# EAGLE design nRF52832_MCU (EAGLE 7.6.0)

## Sheet 1 of 2
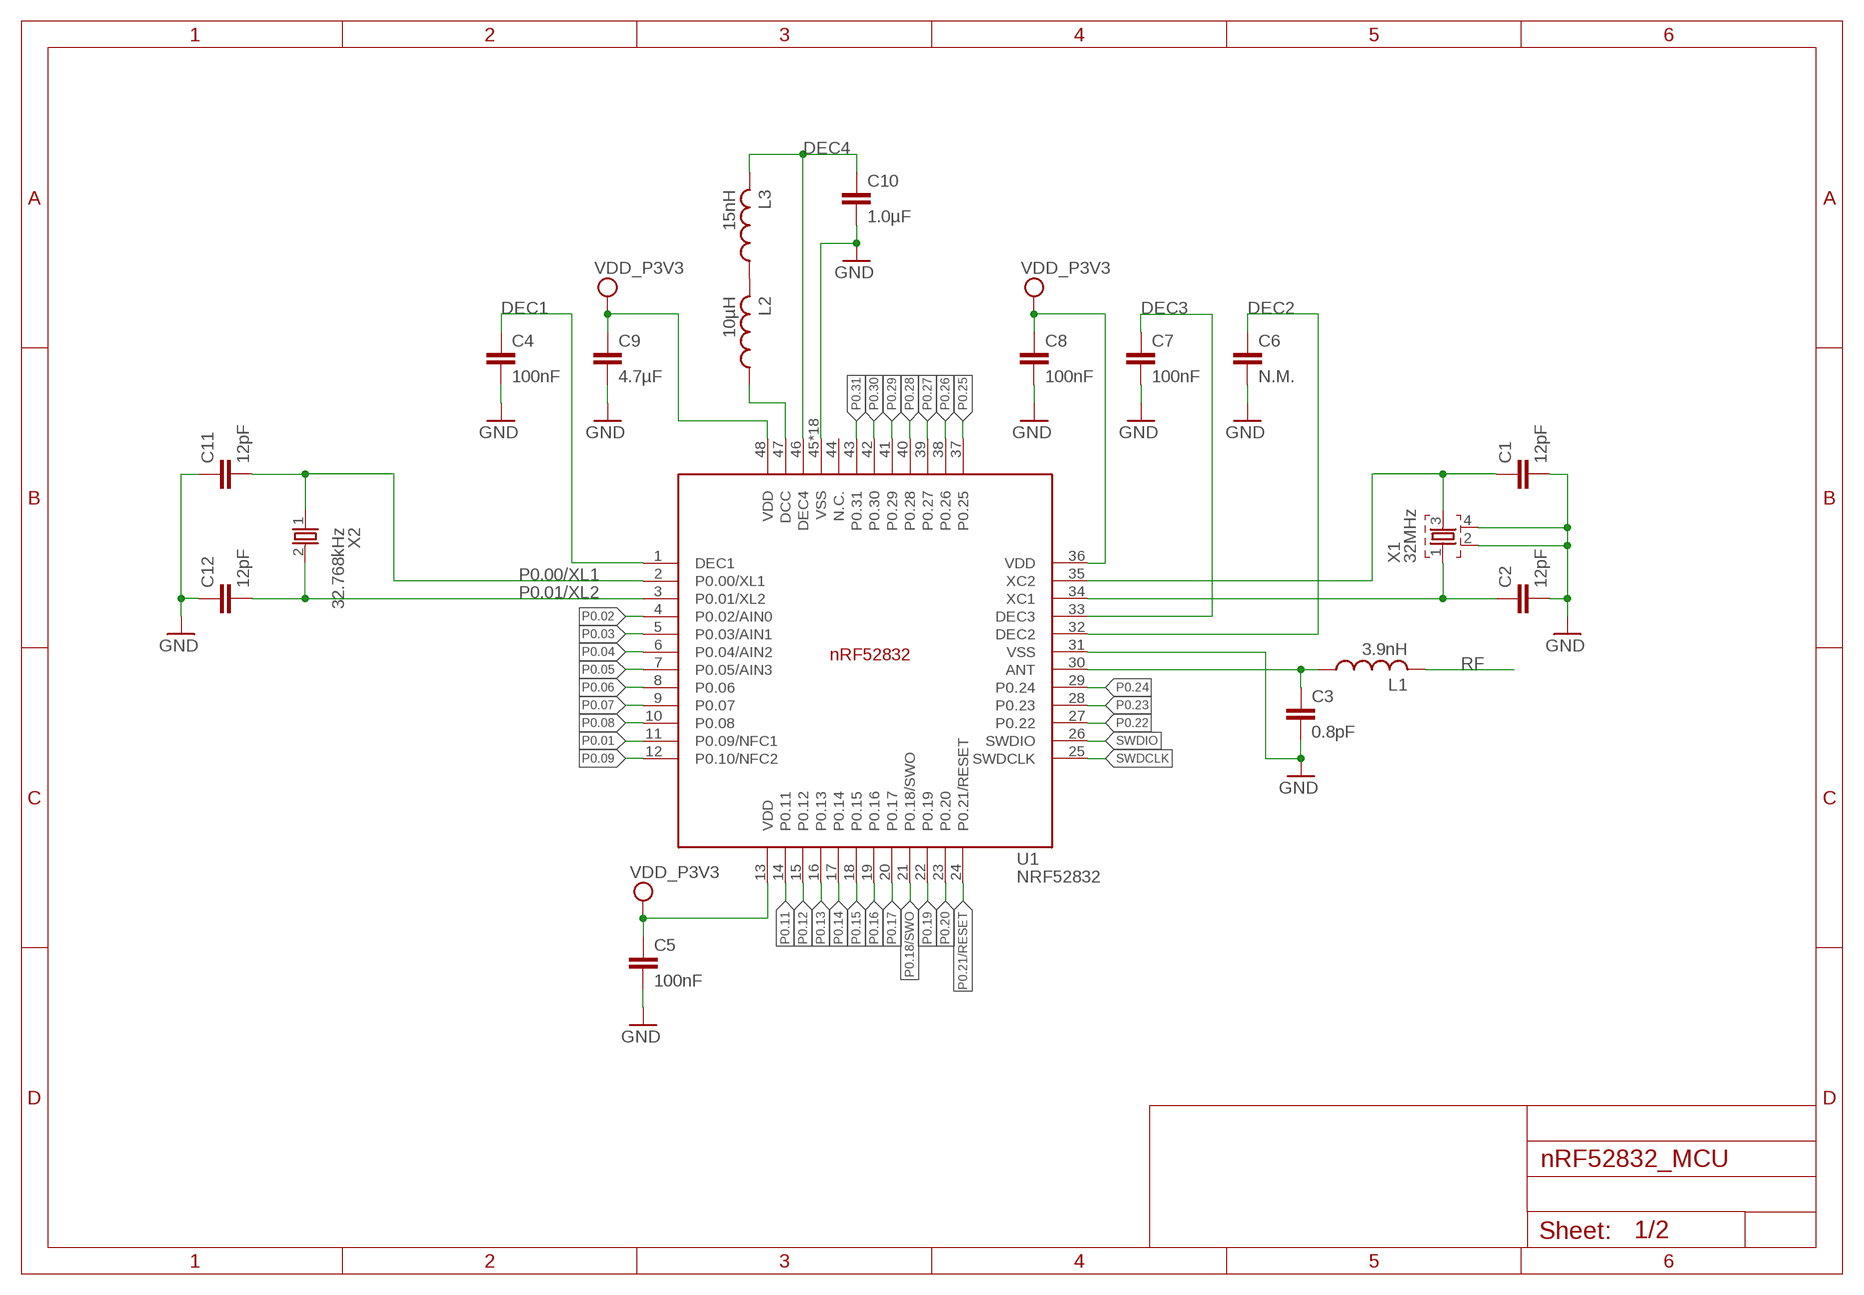
[diagram p0: schematic, sheet 1]

### Parts
C1  12pF  CAPACITOR_0402_N  [RESC0402_N]
C2  12pF  CAPACITOR_0402_N  [RESC0402_N]
C3  0.8pF  CAPACITOR_0402_N  [RESC0402_N]
C4  100nF  CAPACITOR_0402_N  [RESC0402_N]
C5  100nF  CAPACITOR_0402_N  [RESC0402_N]
C6  N.M.  CAPACITOR_0402_N  [RESC0402_N]
C7  100nF  CAPACITOR_0402_N  [RESC0402_N]
C8  100nF  CAPACITOR_0402_N  [RESC0402_N]
C9  4.7µF  CAPACITOR_0603_N  [RESC0603_N]
C10  1.0µF  CAPACITOR_0603_N  [RESC0603_N]
C11  12pF  CAPACITOR_0402_N  [RESC0402_N]
C12  12pF  CAPACITOR_0402_N  [RESC0402_N]
L1  3.9nH  INDUCTOR_0402_N  [RESC0402_N]
L2  10µH  INDUCTOR_0603_N  [RESC0603_N]
L3  15nH  INDUCTOR_0402_N  [RESC0402_N]
U1  NRF52832  [QFN40P600X600X90-48_N]
X1  32MHz  XTAL_32MHZ  [BT-XTAL_2016_N]
X2  32.768kHz  XTAL_32KHZ  [XTAL_3215_N]

### Nets
ANT: C3.1 L1.1 U1.30(ANT)
DEC1: C4.1 U1.1(DEC1)
DEC2: C6.1 U1.32(DEC2)
DEC3: C7.1 U1.33(DEC3)
DEC4: C10.1 L3.2 U1.46(DEC4)
GND: C1.2 C2.2 C3.2 C4.2 C5.2 C6.2 C7.2 C8.2 C9.2 C10.2 C11.1 C12.1 U1.31(VSS) U1.45(VSS) U1.PAD(VSS) U1.PAD@VIA01(VSS) U1.PAD@VIA02(VSS) U1.PAD@VIA03(VSS) U1.PAD@VIA04(VSS) U1.PAD@VIA05(VSS) U1.PAD@VIA06(VSS) U1.PAD@VIA07(VSS) U1.PAD@VIA08(VSS) U1.PAD@VIA09(VSS) U1.PAD@VIA10(VSS) U1.PAD@VIA11(VSS) U1.PAD@VIA12(VSS) U1.PAD@VIA13(VSS) U1.PAD@VIA14(VSS) U1.PAD@VIA15(VSS) U1.PAD@VIA16(VSS) X1.2 X1.4
N$2: L2.2 L3.1
N$3: C1.1 U1.35(XC2) X1.3
N$4: L2.1 U1.47(DCC)
P0.00/XL1: C11.2 U1.2(P0.00/XL1) X2.1
P0.01: U1.11(P0.09/NFC1)
P0.01/XL2: C12.2 U1.3(P0.01/XL2) X2.2
P0.02: U1.4(P0.02/AIN0)
P0.03: U1.5(P0.03/AIN1)
P0.04: U1.6(P0.04/AIN2)
P0.05: U1.7(P0.05/AIN3)
P0.06: U1.8(P0.06)
P0.07: U1.9(P0.07)
P0.08: U1.10(P0.08)
P0.09: U1.12(P0.10/NFC2)
P0.11: U1.14(P0.11)
P0.12: U1.15(P0.12)
P0.13: U1.16(P0.13)
P0.14: U1.17(P0.14)
P0.15: U1.18(P0.15)
P0.16: U1.19(P0.16)
P0.17: U1.20(P0.17)
P0.18/SWO: U1.21(P0.18/SWO)
P0.19: U1.22(P0.19)
P0.20: U1.23(P0.20)
P0.21/RESET: U1.24(P0.21/RESET)
P0.22: U1.27(P0.22)
P0.23: U1.28(P0.23)
P0.24: U1.29(P0.24)
P0.25: U1.37(P0.25)
P0.26: U1.38(P0.26)
P0.27: U1.39(P0.27)
P0.28: U1.40(P0.28)
P0.29: U1.41(P0.29)
P0.30: U1.42(P0.30)
P0.31: U1.43(P0.31)
RF: L1.2
SWDCLK: U1.25(SWDCLK)
SWDIO: U1.26(SWDIO)
VDD_P3V3: C5.1 C8.1 C9.1 U1.13(VDD) U1.36(VDD) U1.48(VDD)
X1: C2.1 U1.34(XC1) X1.1
Unconnected: U1.44(N.C.)

## Sheet 2 of 2
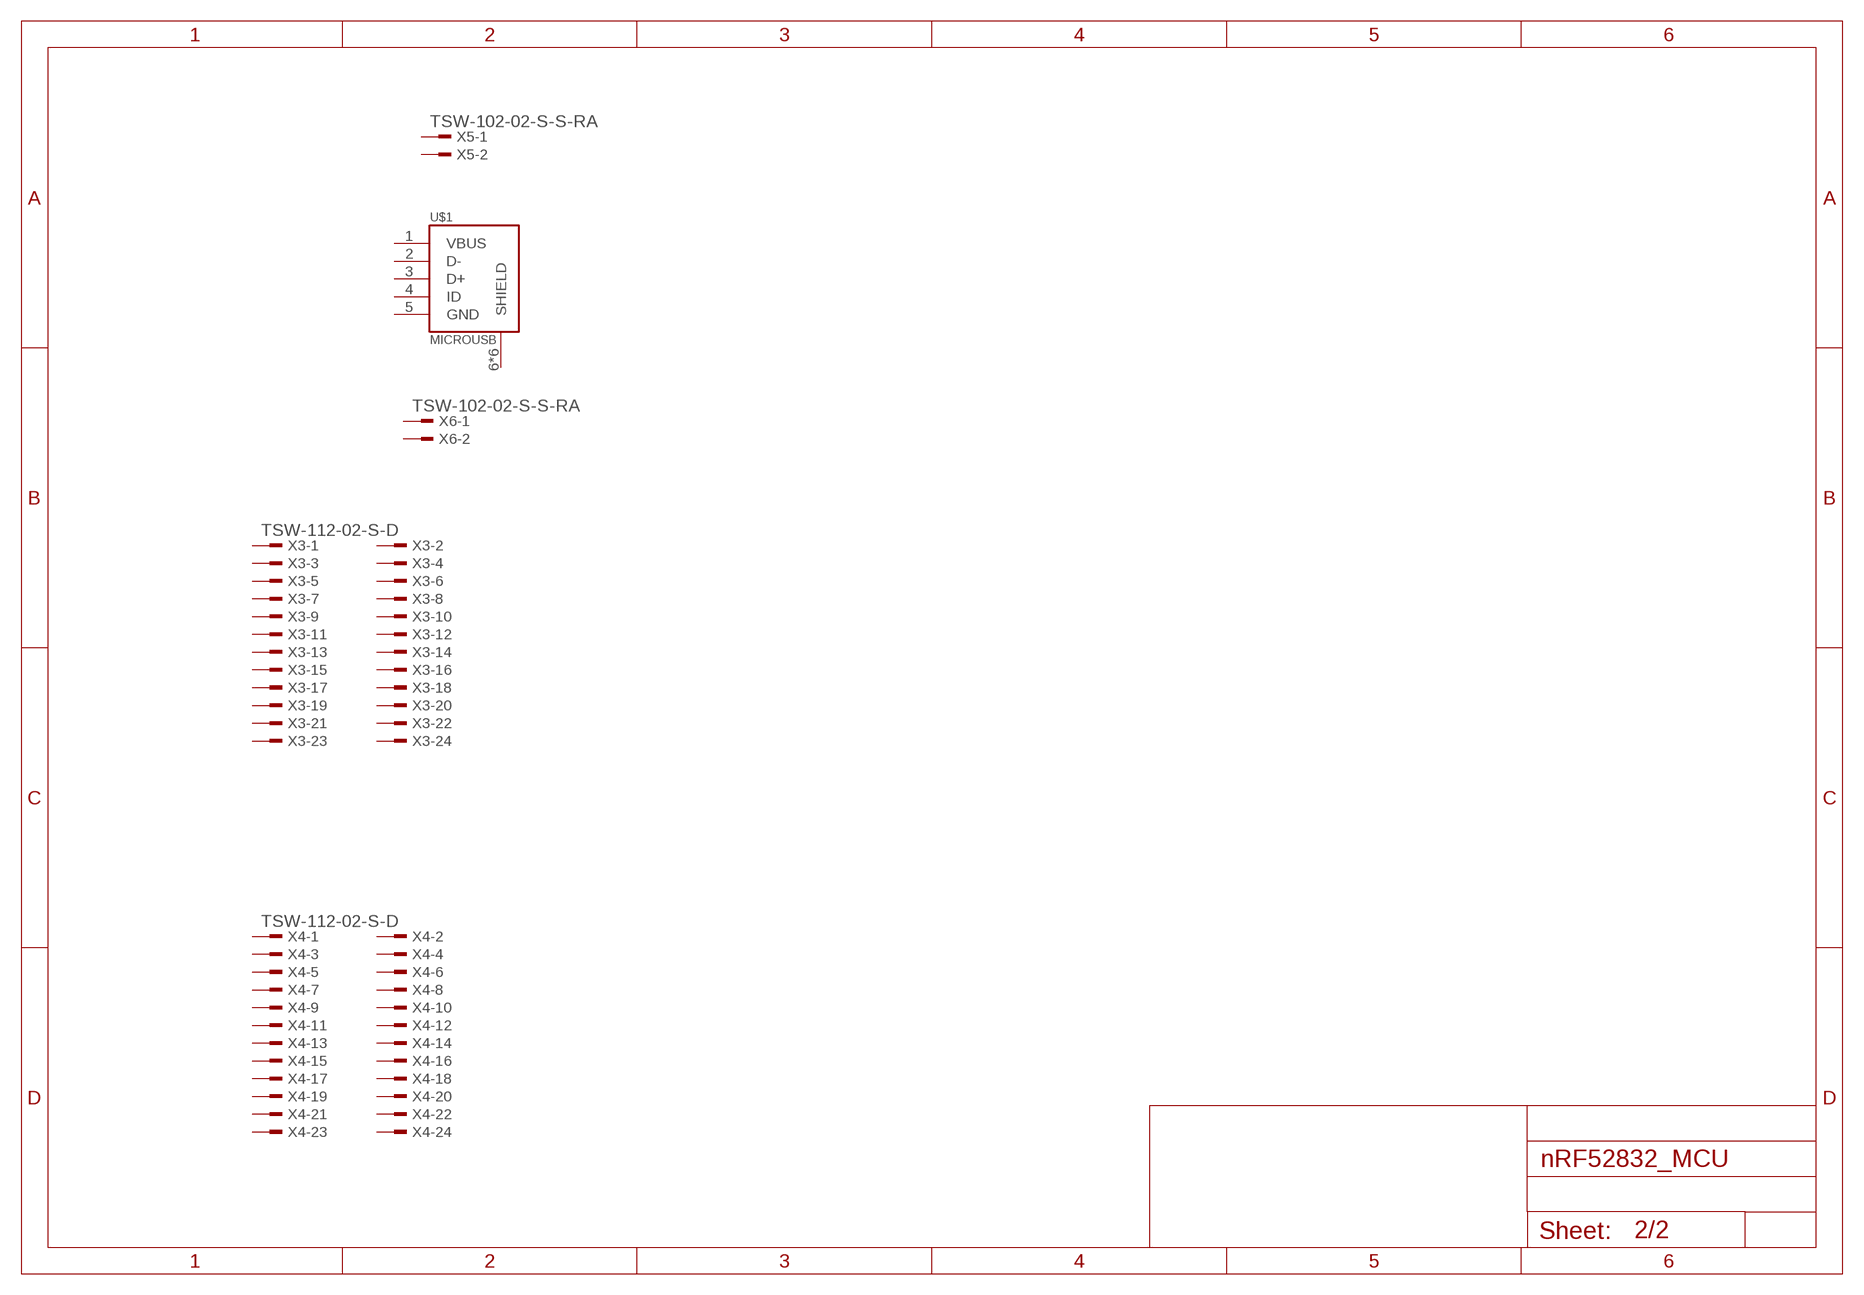
[diagram p1: schematic, sheet 2]

### Parts
U$1  MICROUSB  [USB-MICRO-B-RA-SMD-PIP]
X3  TSW-112-02-S-D  [TSW-112-02-S-D]
X4  TSW-112-02-S-D  [TSW-112-02-S-D]
X5  TSW-102-02-S-S-RA  [TSW-102-02-S-S-RA]
X6  TSW-102-02-S-S-RA  [TSW-102-02-S-S-RA]
Unconnected: U$1.1(VBUS) U$1.2(D-) U$1.3(D+) U$1.4(ID) U$1.5(GND) U$1.6(SHIELD) U$1.7(SHIELD) U$1.8(SHIELD) U$1.9(SHIELD) U$1.10(SHIELD) U$1.11(SHIELD) X3.1 X3.2 X3.3 X3.4 X3.5 X3.6 X3.7 X3.8 X3.9 X3.10 X3.11 X3.12 X3.13 X3.14 X3.15 X3.16 X3.17 X3.18 X3.19 X3.20 X3.21 X3.22 X3.23 X3.24 X4.1 X4.2 X4.3 X4.4 X4.5 X4.6 X4.7 X4.8 X4.9 X4.10 X4.11 X4.12 X4.13 X4.14 X4.15 X4.16 X4.17 X4.18 X4.19 X4.20 X4.21 X4.22 X4.23 X4.24 X5.1 X5.2 X6.1 X6.2

## Library data of the parts
C1-C12 = Nordic_nRF:CAPACITOR: Generic chip capacitor
L1-L3 = Nordic_nRF:INDUCTOR: Generic chip inductor
U1 = Nordic_nRF:NRF52832: nRF52832 Features Single chip, highly flexible, 2.4 GHz multi-protocol SoC 32-bit ARM Cortex-M4F Processor 1.7v to 3.6v operation 512kB flash + 64kB RAM Supports concurrent Bluetooth Smart/ANT protocol operation On-chip NFC tag for Out-of-Band (OOB) pairing Up to +4dBm output power -96dBm sensitivity, Bluetooth Smart Thread safe and run-time protected Event driven API On air compatible with nRF24L and nRF24AP series 2 data rates (2Mbps/1Mbps) PPI - maximum flexibility for power-efficient applications and code simplification Automated power management system with automatic power management of each peripheral Configurable I/O mapping for analog and digital I/O 3 x Master/Slave SPI 2 x Two-wire interface (I²C) UART (RTS/CTS) 3 x PWM AES HW encryption Real Time Counter (RTC) Digital microphone interface (PDM) On-chip balun Applications Internet of Things (IoT) Wearables SmartHome sensors Connected white goods Computer peripherals Voice-command smart remotes A4WP ‘Rezence’ wireless charging Beacons Sports and fitness sensors and hubs Connected health products Smart watches RC Toys Interactive games Building automation and sensor networks
U$1 = Nordic_misc:MICROUSB
X1 = Nordic_nRF:XTAL_32MHZ
X2 = Nordic_nRF:XTAL_32KHZ
X3 X4 = con-samtec:TSW-112-02-S-D: THROUGH-HOLE .025" SQ POST HEADER Source: Samtec TSW.pdf; OC_FARNELL: unknown; OC_NEWARK: unknown
X5 X6 = con-samtec:TSW-102-02-S-S: THROUGH-HOLE .025" SQ POST HEADER Source: Samtec TSW.pdf; OC_FARNELL: unknown; OC_NEWARK: unknown

## Board
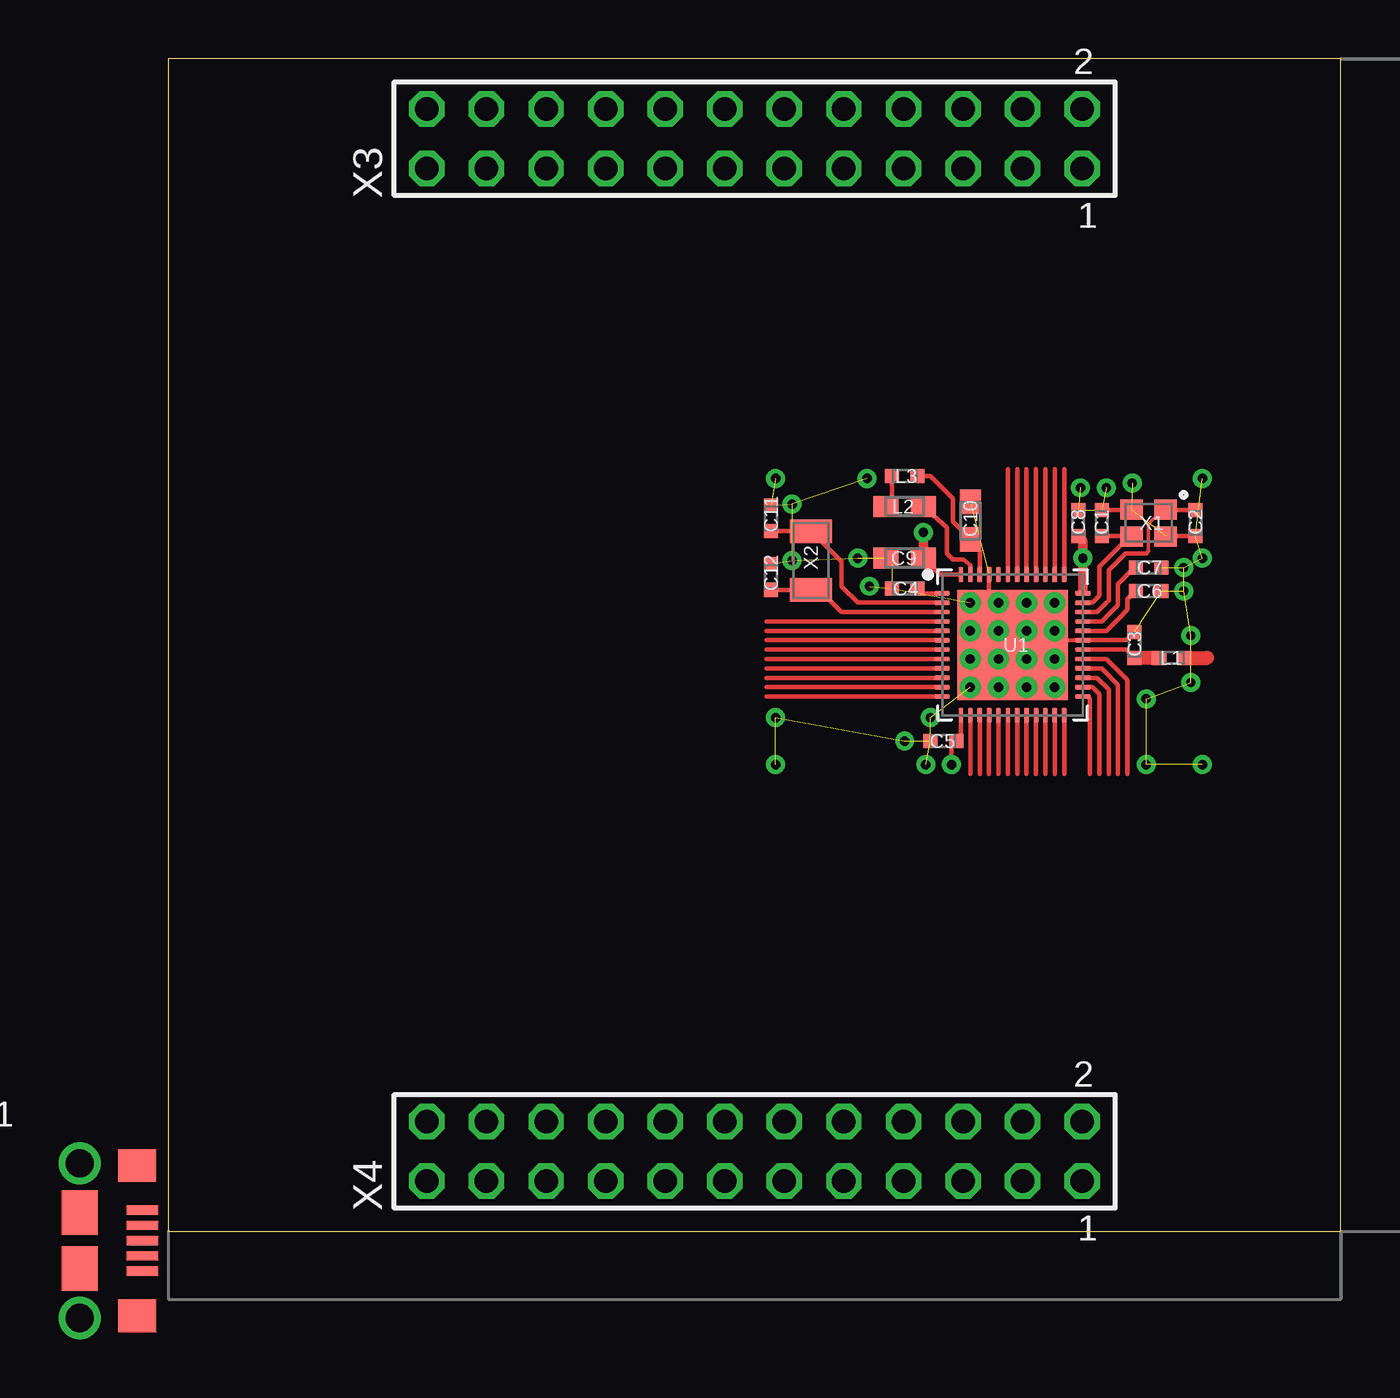
[diagram p2: board, top side]
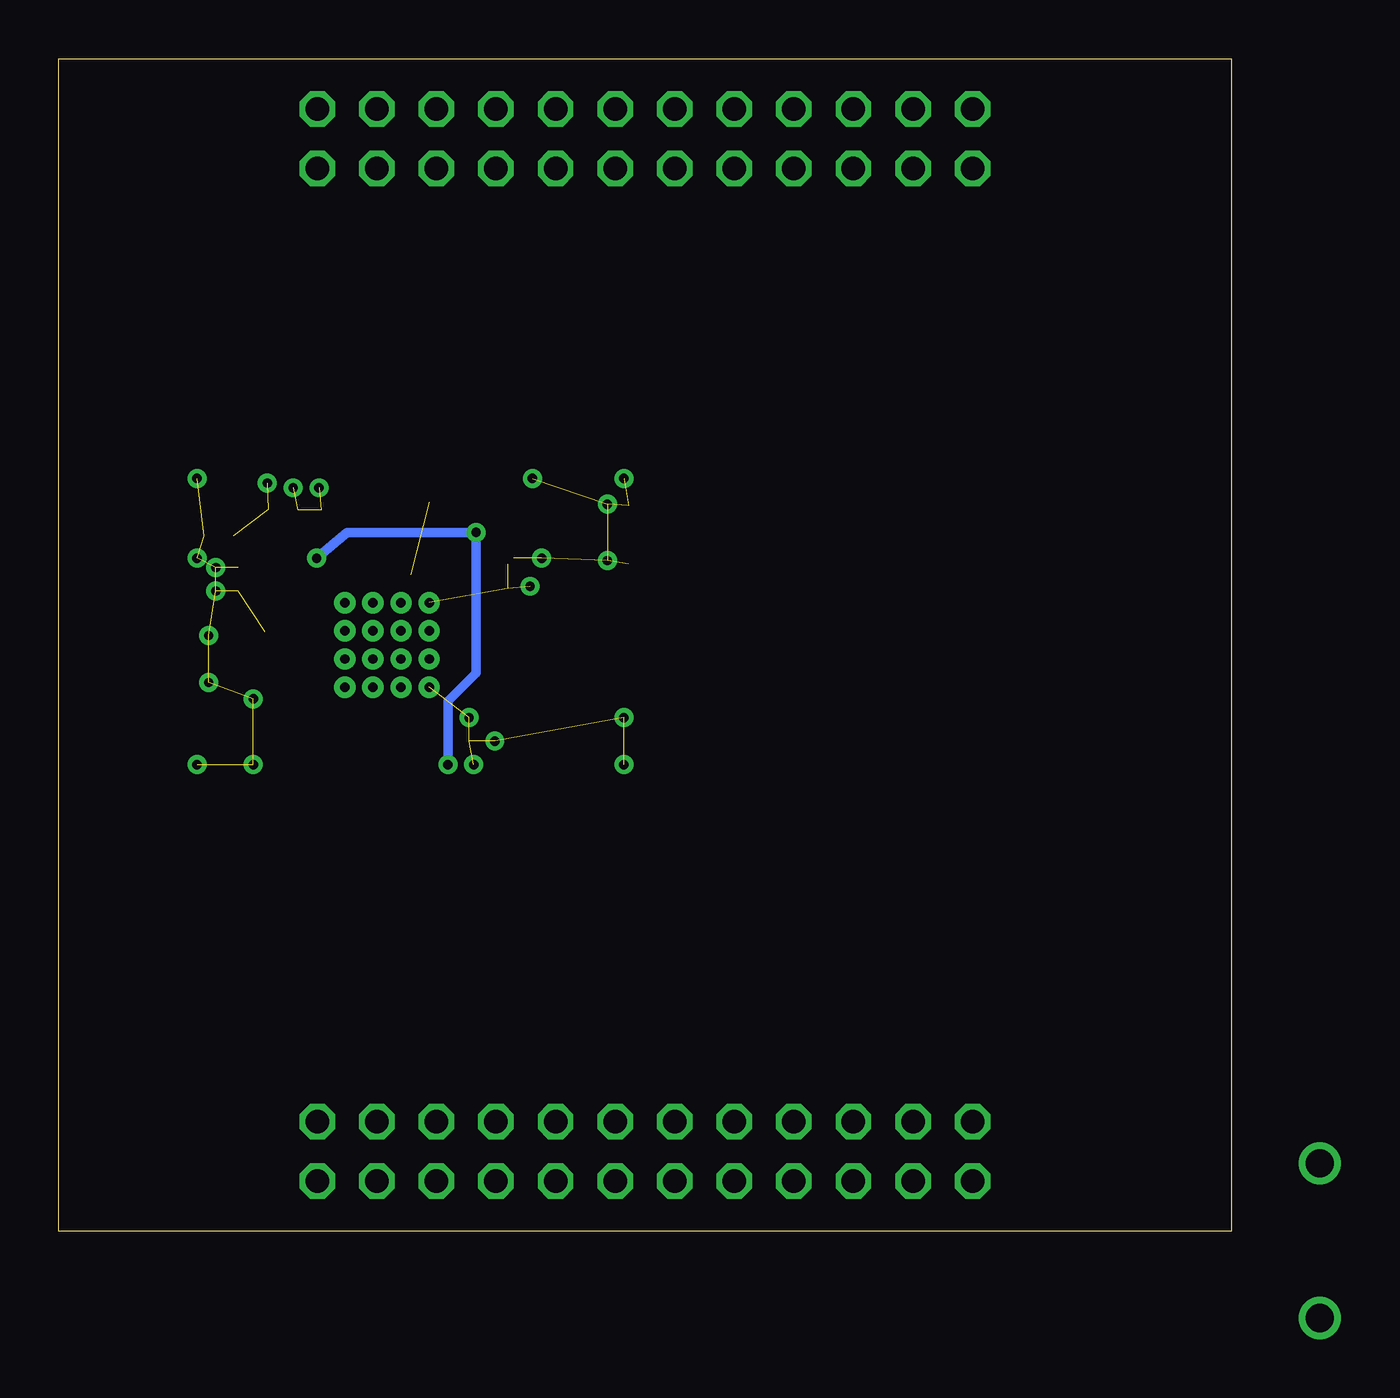
[diagram p3: board, bottom side, seen from below]

Size 50 x 50 mm. Coordinates in mm from the lower left corner, seen from the top.
Outline: 0,0 50,0 50,50 0,50 0,0
Copper layers (1*16): Top 0.035mm / dielectric 1.5mm / Bottom 0.035mm
Design rules "Nordic": minimum track width 0.15mm, minimum drill 0.4mm, track to track 0.15mm, track to pad 0.15mm, pad to pad 0.15mm, via to via 0.15mm, smd to smd 0.15mm, copper to edge 0.4mm, drill to drill 0.4mm, minimum pad ring 10mil, minimum via ring 8mil, stop-mask expansion 4mil, vias tented up to drill 0mil, thermal gap 0.2mm
tRestrict: area 39.4,23.2 to 43,27

### Footprints (pad centres in the part's own frame; a part is rotated, then mirrored left to right if it is on the bottom)
RESC0402_N = smd 0.6 x 0.6: 1 -0.55,0; 2 0.55,0
RESC0603_N = smd 1.05 x 0.9: 1 -0.8,0; 2 0.8,0
QFN40P600X600X90-48_N = smd 0.65 x 0.2: 1 -3,2.2; 2 -3,1.8; 3 -3,1.4; 4 -3,1; 5 -3,0.6; 6 -3,0.2; 7 -3,-0.2; 8 -3,-0.6; 9 -3,-1; 10 -3,-1.4; 11 -3,-1.8; 12 -3,-2.2; 25 3,-2.2; 26 3,-1.8; 27 3,-1.4; 28 3,-1; 29 3,-0.6; 30 3,-0.2; 31 3,0.2; 32 3,0.6; 33 3,1; 34 3,1.4; 35 3,1.8; 36 3,2.2 | smd 0.2 x 0.65: 13 -2.2,-3; 14 -1.8,-3; 15 -1.4,-3; 16 -1,-3; 17 -0.6,-3; 18 -0.2,-3; 19 0.2,-3; 20 0.6,-3; 21 1,-3; 22 1.4,-3; 23 1.8,-3; 24 2.2,-3; 37 2.2,3; 38 1.8,3; 39 1.4,3; 40 1,3; 41 0.6,3; 42 0.2,3; 43 -0.2,3; 44 -0.6,3; 45 -1,3; 46 -1.4,3; 47 -1.8,3; 48 -2.2,3 | smd 4.7 x 4.7: PAD 0,0 | drill 0.4: PAD@VIA01 -1.8,1.8; PAD@VIA02 -1.8,0.6; PAD@VIA03 -1.8,-0.6; PAD@VIA04 -1.8,-1.8; PAD@VIA05 -0.6,1.8; PAD@VIA06 -0.6,0.6; PAD@VIA07 -0.6,-0.6; PAD@VIA08 -0.6,-1.8; PAD@VIA09 0.6,1.8; PAD@VIA10 0.6,0.6; PAD@VIA11 0.6,-0.6; PAD@VIA12 0.6,-1.8; PAD@VIA13 1.8,1.8; PAD@VIA14 1.8,0.6; PAD@VIA15 1.8,-0.6; PAD@VIA16 1.8,-1.8
USB-MICRO-B-RA-SMD-PIP = smd 1.35 x 0.4: 1 0,1.3; 2 0,0.65; 3 0,0; 4 0,-0.65; 5 0,-1.3 | smd 1.6 x 1.4: 6 -0.225,3.2; 7 -0.225,-3.2 | smd 1.55 x 1.9: 8 -2.675,1.2; 9 -2.675,-1.2 | drill 1.2: 10 -2.675,3.3; 11 -2.675,-3.3
BT-XTAL_2016_N = smd 0.95 x 0.85: 1 -0.725,-0.575; 2 0.725,-0.575; 3 0.725,0.575; 4 -0.725,0.575
XTAL_3215_N = smd 1 x 1.8: 1 -1.25,0; 2 1.25,0
TSW-112-02-S-D = drill 1 pad 1.5 octagon: 1 13.97,-1.27; 2 13.97,1.27; 3 11.43,-1.27; 4 11.43,1.27; 5 8.89,-1.27; 6 8.89,1.27; 7 6.35,-1.27; 8 6.35,1.27; 9 3.81,-1.27; 10 3.81,1.27; 11 1.27,-1.27; 12 1.27,1.27; 13 -1.27,-1.27; 14 -1.27,1.27; 15 -3.81,-1.27; 16 -3.81,1.27; 17 -6.35,-1.27; 18 -6.35,1.27; 19 -8.89,-1.27; 20 -8.89,1.27; 21 -11.43,-1.27; 22 -11.43,1.27; 23 -13.97,-1.27; 24 -13.97,1.27
TSW-102-02-S-S-RA = drill 1 pad 1.5 octagon: 1 1.27,1.524; 2 -1.27,1.524

### Placement (x,y rotation side)
C1  39.8,30.2 90 top
C2  43.8,30.2 270 top
C3  41.2,25 90 top
C4  31.4,27.4 180 top
C5  33.05,20.9 180 top
C6  41.8,27.3 0 top
C7  41.8,28.3 0 top
C8  38.8,30.2 90 top
C9  31.4,28.7 180 top
C10  34.2,30.3 90 top
C11  25.7,30.4 270 top
C12  25.7,27.9 270 top
L1  42.8,24.45 0 top
L2  31.4,30.9 180 top
L3  31.4,32.2 0 top
U1  36,25 0 top
U$1  -1.1,-0.4 0 top
X1  41.8,30.2 180 top
X2  27.4,28.6 270 top
X3  25,46.59 0 top
X4  25,3.41 0 top
X5  -10,3.3 0 top  (outside the outline)
X6  -19.9,3.3 0 top  (outside the outline)

### Tracks (layer width: path | path; a pad name or v marks a point on that pad's centre or on a via)
ANT
  Top 0.2: U1.30 40.85,24.8 C3.1 41.25,24.45
  Top 0.6: L1.1 41.25,24.45
DEC1
  Top 0.2: U1.1 32.15,27.2 C4.1
DEC2
  Top 0.2: U1.32 40,25.6 40.6,26.2 40.9,26.5 40.9,26.7 40.9,26.95 C6.1
DEC3
  Top 0.2: U1.33 39.8,26 40.2,26.4 40.5,26.7 40.5,27.6 41.15,28.25 C7.1
DEC4
  Top 0.2: U1.46 34.6,29 C10.1 33.45,30.25 33.45,30.45 33.45,31.25 32.5,32.2 L3.2
GND  (via drill 0.4 pad 0.8)  (34 unrouted)
  Top 0.2: 37.85,25.19 U1.31 40.85,25.2 C3.2 | 37.85,25.19 arc-90 U1.PAD@VIA14 | 35.05,26.99 arc90 U1.PAD@VIA05 | U1.PAD@VIA01 35,26.8 | 35,26.8 U1.PAD@VIA05 | U1.PAD@VIA05 U1.PAD@VIA09 U1.PAD@VIA13 U1.PAD@VIA14 | U1.PAD@VIA02 U1.PAD@VIA06 | U1.PAD@VIA06 U1.PAD@VIA10 U1.PAD@VIA14 | 37.85,25.19 37.85,24.79 arc-90 U1.PAD@VIA15 | U1.PAD@VIA15 U1.PAD@VIA16 U1.PAD@VIA12 | U1.PAD@VIA15 U1.PAD@VIA11 U1.PAD@VIA07 U1.PAD@VIA03 U1.PAD@VIA04 U1.PAD@VIA08 | U1.PAD@VIA06 arc90 U1.PAD | U1.45 35,26.8 | C2.2 42.55,29.65 X1.4 | C1.2 41.05,30.75 X1.2 | 30.85,28.45 C9.2
  other vias: 26.6,28.6 26.6,31 29.4,28.7 38.9,31.7 43.3,28.3 43.3,27.3 29.9,27.5 44.1,28.7 41.1,31.9 40,31.7 32.3,19.9 32.5,21.9 43.6,23.4 43.6,25.4 25.9,32.1 29.8,32.1 44.1,32.1 41.7,22.7 44.1,19.9 41.7,19.9 31.4,20.9 25.9,19.9 25.9,21.9
N$2
  Top 0.2: L3.1 30.85,30.9 L2.2
N$3
  Top 0.2: U1.35 39.4,26.8 39.7,27.1 39.7,27.9 39.7,28.35 41,29.65 | C1.1 41,29.65 | 41,29.65 41.05,29.65 X1.3
N$4
  Top 0.2: U1.47 34.2,28.4 33.9,28.65 33.45,28.65 33.2,28.9 33.2,30 L2.1
P0.00/XL1
  Top 0.2: C11.2 X2.1 28.7,28.55 28.7,27.5 29.4,26.8 U1.2
P0.01
  Top 0.2: U1.11 25.5,23.2
P0.01/XL2
  Top 0.2: C12.2 X2.2 27.65,27.1 28,27.1 28.7,26.4 U1.3
P0.02
  Top 0.2: U1.4 25.5,26
P0.03
  Top 0.2: U1.5 25.5,25.6
P0.04
  Top 0.2: U1.6 25.5,25.2
P0.05
  Top 0.2: U1.7 25.5,24.8
P0.06
  Top 0.2: U1.8 25.5,24.4
P0.07
  Top 0.2: U1.9 25.5,24
P0.08
  Top 0.2: U1.10 25.5,23.6
P0.09
  Top 0.2: U1.12 25.5,22.8
P0.11
  Top 0.2: U1.14 34.2,19.5
P0.12
  Top 0.2: U1.15 34.6,19.5
P0.13
  Top 0.2: U1.16 35,19.5
P0.14
  Top 0.2: U1.17 35.4,19.5
P0.15
  Top 0.2: U1.18 35.8,19.5
P0.16
  Top 0.2: U1.19 36.2,19.5
P0.17
  Top 0.2: U1.20 36.6,19.5
P0.18/SWO
  Top 0.2: U1.21 37,19.5
P0.19
  Top 0.2: U1.22 37.4,19.5
P0.20
  Top 0.2: U1.23 37.8,19.5
P0.21/RESET
  Top 0.2: U1.24 38.2,19.5
P0.22
  Top 0.2: U1.27 39.6,23.6 40.1,23.1 40.1,19.5
P0.23
  Top 0.2: U1.28 39.8,24 39.9,23.9 40.5,23.3 40.5,19.5
P0.24
  Top 0.2: U1.29 40,24.4 40.7,23.7 40.8,23.6 40.9,23.5 40.9,19.5
P0.25
  Top 0.2: U1.37 38.2,32.5
P0.26
  Top 0.2: U1.38 37.8,32.5
P0.27
  Top 0.2: U1.39 37.4,32.5
P0.28
  Top 0.2: U1.40 37,32.5
P0.29
  Top 0.2: U1.41 36.6,32.5
P0.30
  Top 0.2: U1.42 36.2,32.5
P0.31
  Top 0.2: U1.43 35.8,32.5
RF
  Top 0.6: L1.2 44.3,24.45
SWDCLK
  Top 0.2: U1.25 39.2,22.8 39.3,22.7 39.3,19.5
SWDIO
  Top 0.2: U1.26 39.4,23.2 39.7,22.9 39.7,19.5
VDD_P3V3  (via drill 0.4 pad 0.8)
  Top 0.2: U1.48 32.9,28 C9.1 | U1.36 39,27.3 | U1.13 33.8,20.9 C5.1 33.4,20.9 v33.4,19.9
  Top 0.4: 39,27.3 v39,28.7 39,29.45 C8.1 | v32.2,29.8 C9.1
  Bottom 0.4: v33.4,19.9 33.4,22.6 32.2,23.8 v32.2,29.8 37.7,29.8 v39,28.7
X1
  Top 0.15: 41.8,29 41.8,30.15 42.42,30.77 X1.1
  Top 0.2: C2.1 42.55,30.75 X1.1 | U1.34 39.6,26.4 40,26.8 40.1,26.9 40.1,27.7 40.1,28.2 40.8,28.9 41.7,28.9 41.8,29